# Altium schematic sheet gydrodrive_sensors.SchDoc
size 297 x 209 mm; SheetNumber: 18; SheetTotal: 22
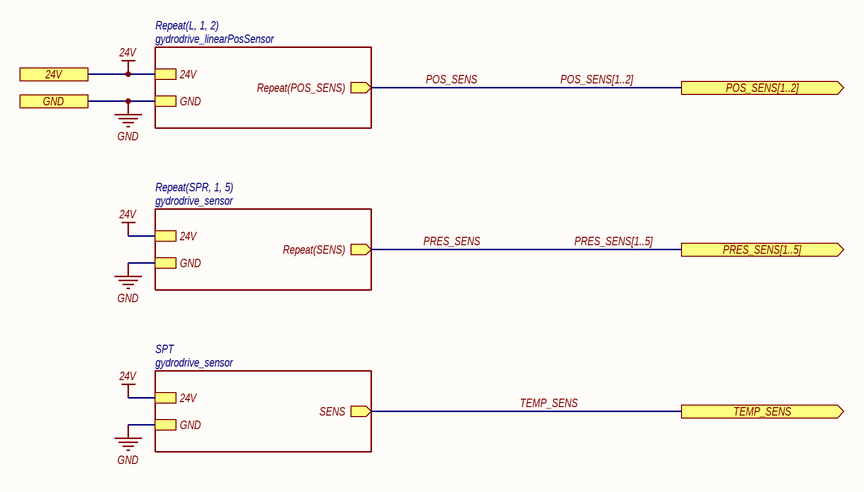
[diagram p0: gydrodrive_sensors.SchDoc]

## Sub-sheets
Repeat(L, 1, 2) = gydrodrive_linearPosSensor: 24V, GND, Repeat(POS_SENS) (out)
Repeat(SPR, 1, 5) = gydrodrive_sensor: Repeat(SENS) (out), 24V, GND
SPT = gydrodrive_sensor: SENS (out), 24V, GND

## Ports
24V (see gydrodrive_main[1B], gydrodrive_button[4B], gydrodrive_control[4B], gydrodrive_currentSource[2B], gydrodrive_discreteControl[4B], gydrodrive_encoder[5B], gydrodrive_linearPosSensor[3B], gydrodrive_sensor[3B], gydrodrive_sto[4B], gydrodrive_supply[2B]), GND (see gydrodrive_main[1B], gydrodrive_button[3C], gydrodrive_can[3C], gydrodrive_control[3B], gydrodrive_currentSource[2B], gydrodrive_debugger[4C], gydrodrive_discreteControl[3B], gydrodrive_encoder[2A], gydrodrive_i2c[5C], gydrodrive_indication[4C], gydrodrive_inputTrim[4C], gydrodrive_interfaces[3A], gydrodrive_linearPosSensor[2C], gydrodrive_mcu[6D], gydrodrive_reservedPins[4B], gydrodrive_rs485[3B], gydrodrive_sensor[3C], gydrodrive_sto[3C], gydrodrive_supply[2C], gydrodrive_uart[4C]), POS_SENS[1..2] (out, see gydrodrive_main[2B], gydrodrive_mcu[1A]), PRES_SENS[1..5] (out, see gydrodrive_main[2B], gydrodrive_mcu[1B]), TEMP_SENS (out, see gydrodrive_main[2B], gydrodrive_mcu[6A])

## Nets
24V: port 24V, sheet Repeat(SPR, 1, 5)/24V, sheet Repeat(L, 1, 2)/24V, sheet SPT/24V
GND: port GND, sheet Repeat(SPR, 1, 5)/GND, sheet Repeat(L, 1, 2)/GND, sheet SPT/GND
POS_SENS: sheet Repeat(L, 1, 2)/Repeat(POS_SENS)
PRES_SENS: sheet Repeat(SPR, 1, 5)/Repeat(SENS)
TEMP_SENS: port TEMP_SENS, sheet SPT/SENS

## Buses and harness runs
bus POS_SENS[1..2] = port POS_SENS[1..2]
bus PRES_SENS[1..5] = port PRES_SENS[1..5]

## Notes on the sheet
- Подп. и дата
- Инв. № дубл.
- Взам. инв. №
- Инв. № подл.
- Изм.
- Лист
- № докум.
- Подп.
- Дата
- Копировал
- Формат
- A4